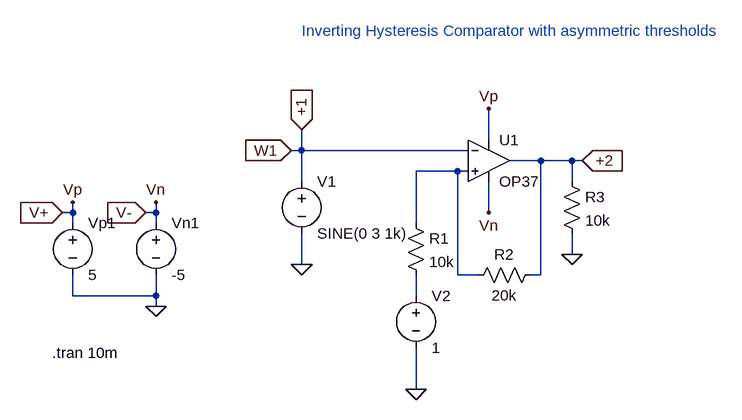
[diagram p0: schematic inv_hys_comp_asy_th.asc]
inv_hys_comp_asy_th.asc, the LTspice schematic file:
Version 4
SHEET 1 880 680
WIRE 304 32 304 -16
WIRE 16 48 16 16
WIRE 16 48 0 48
WIRE 272 48 16 48
WIRE 384 64 336 64
WIRE 432 64 384 64
WIRE 448 64 432 64
WIRE 256 80 192 80
WIRE 272 80 256 80
WIRE 16 96 16 48
WIRE 432 96 432 64
WIRE -336 144 -336 128
WIRE -336 144 -352 144
WIRE -208 144 -208 128
WIRE -208 144 -224 144
WIRE 304 144 304 96
WIRE -336 160 -336 144
WIRE -208 160 -208 144
WIRE 192 160 192 80
WIRE 432 208 432 176
WIRE 16 224 16 176
WIRE 256 240 256 80
WIRE 288 240 256 240
WIRE 384 240 384 64
WIRE 384 240 368 240
WIRE -336 272 -336 240
WIRE -208 272 -208 240
WIRE -208 272 -336 272
WIRE 192 272 192 240
WIRE -208 288 -208 272
WIRE 192 416 192 352
FLAG 192 416 0
FLAG 304 144 Vn
FLAG 304 -16 Vp
FLAG 432 208 0
FLAG 16 224 0
FLAG 16 16 +1
IOPIN 16 16 In
FLAG 0 48 W1
IOPIN 0 48 In
FLAG 448 64 +2
IOPIN 448 64 In
FLAG -208 288 0
FLAG -336 128 Vp
FLAG -208 128 Vn
FLAG -352 144 V+
IOPIN -352 144 In
FLAG -224 144 V-
IOPIN -224 144 In
SYMBOL voltage 16 80 R0
WINDOW 123 0 0 Left 0
WINDOW 39 0 0 Left 0
SYMATTR InstName V1
SYMATTR Value SINE(0 3 1k)
SYMBOL res 416 80 R0
SYMATTR InstName R3
SYMATTR Value 10k
SYMBOL res 176 144 R0
SYMATTR InstName R1
SYMATTR Value 10k
SYMBOL res 384 224 R90
WINDOW 0 0 56 VBottom 2
WINDOW 3 32 56 VTop 2
SYMATTR InstName R2
SYMATTR Value 20k
SYMBOL Opamps\\OP37 304 0 R0
SYMATTR InstName U1
SYMBOL voltage 192 256 R0
WINDOW 123 0 0 Left 0
WINDOW 39 0 0 Left 0
SYMATTR InstName V2
SYMATTR Value 1
SYMBOL voltage -208 144 R0
WINDOW 123 0 0 Left 0
WINDOW 39 0 0 Left 0
SYMATTR InstName Vn1
SYMATTR Value -5
SYMBOL voltage -336 144 R0
WINDOW 123 0 0 Left 0
WINDOW 39 0 0 Left 0
SYMATTR InstName Vp1
SYMATTR Value 5
TEXT 16 -136 Left 2 ;Inverting Hysteresis Comparator with asymmetric thresholds
TEXT -368 360 Left 2 !.tran 10m

The netlist it stands for:
* inv_hys_comp_asy_th.asc
V1 W1 0 SINE(0 3 1k)
R3 +2 0 10k
R1 N001 N002 10k
R2 +2 N001 20k
XU1 N001 W1 V+ V- +2 LT1037  ; OP37, pins In+ In- V+ V- OUT
V2 N002 0 1
Vn1 V- 0 -5
Vp1 V+ 0 5
* Inverting Hysteresis Comparator with asymmetric thresholds
.tran 10m
.lib LTC.lib
.backanno
.end